# EAGLE design WallFollower-Circle (EAGLE 9.5.2)
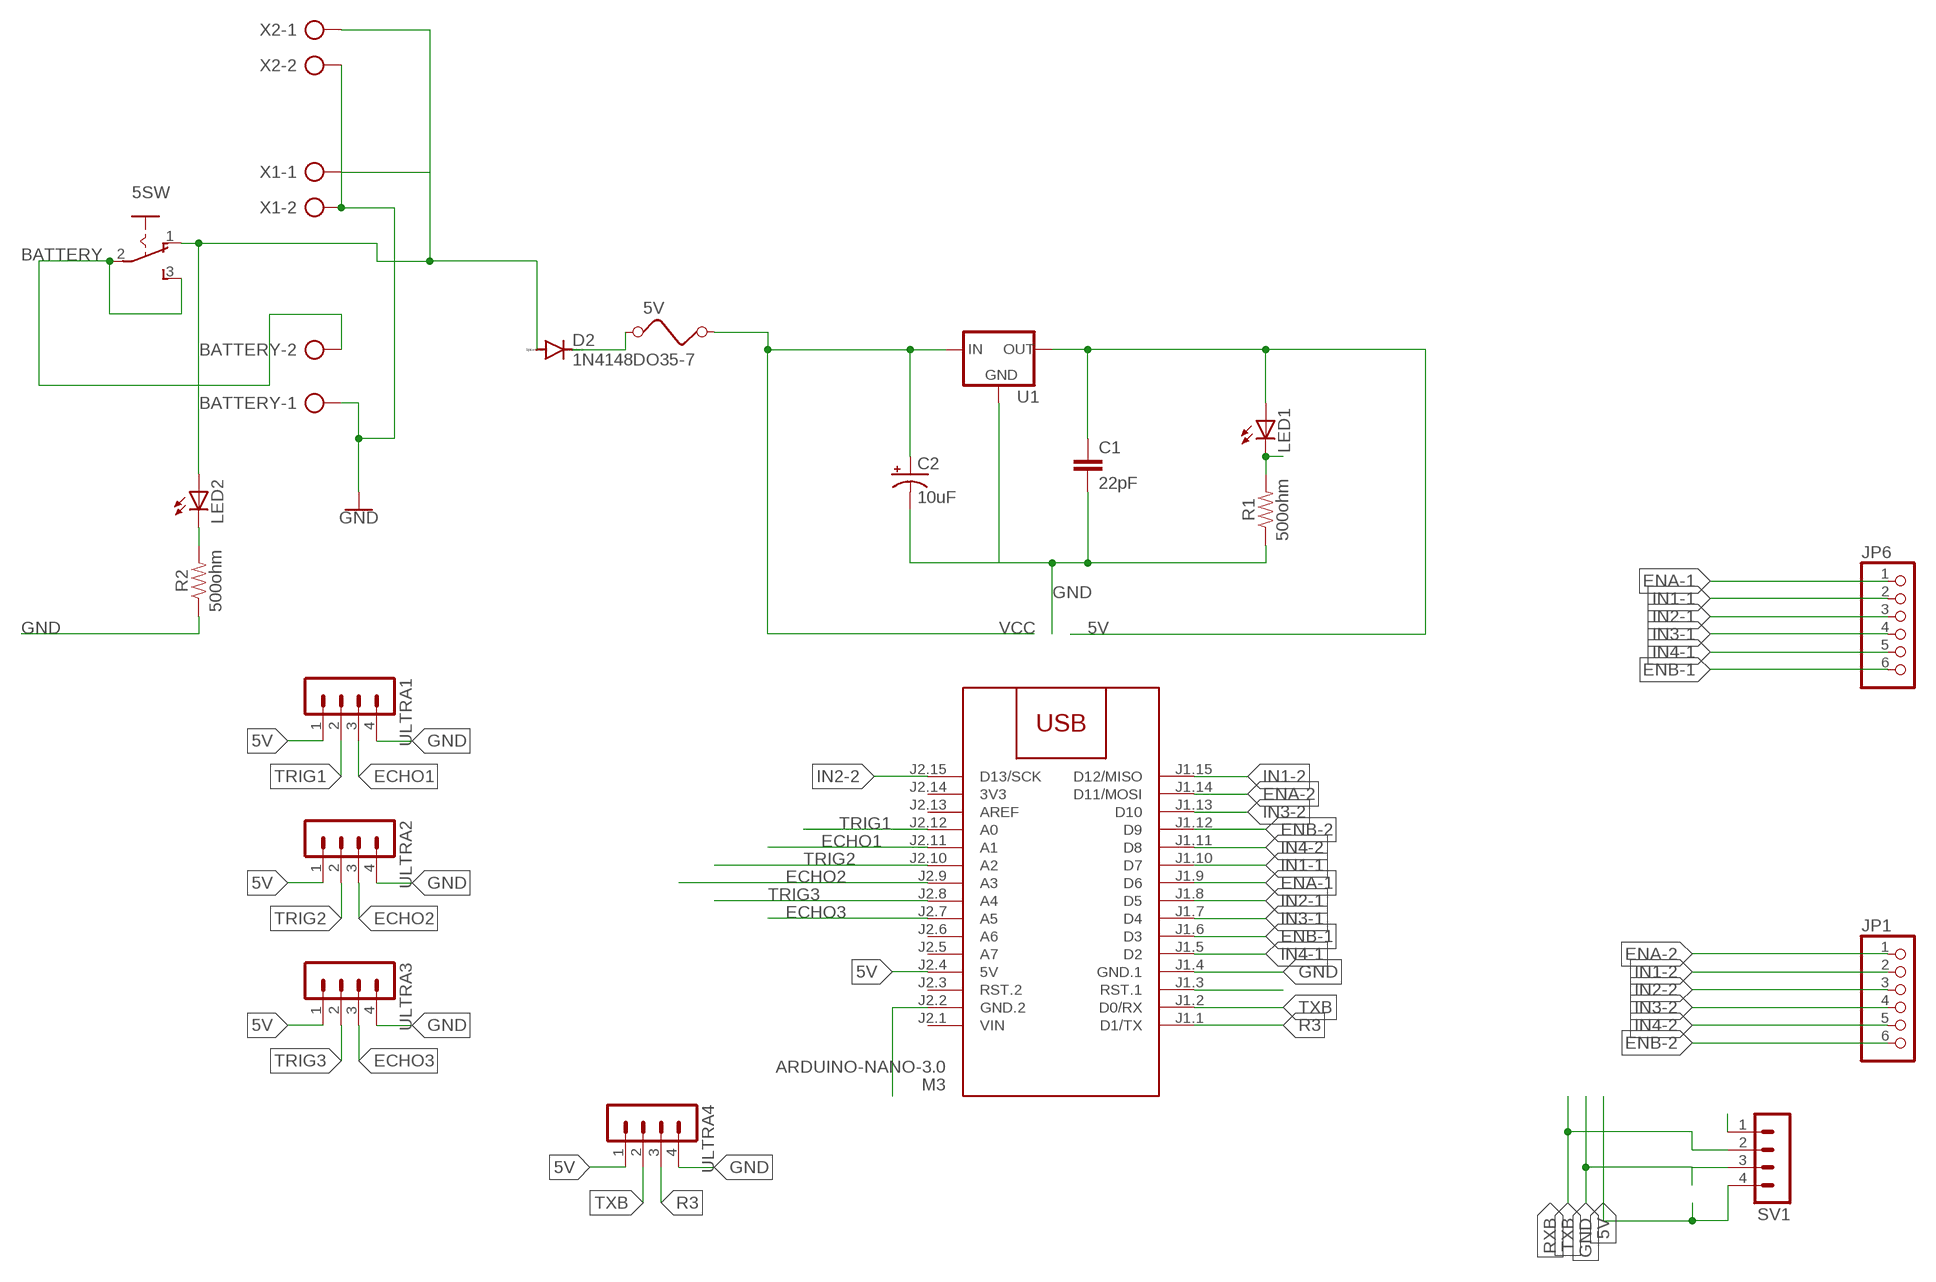
[diagram p0: schematic, sheet 1]

## Parts
5SW  255SB  [255SB]
5V  FUSE  [FUSE]
BATTERY  AK500/2-H  [AK500/2-H]
C1  22pF  22PF-PTH-2.54MM-200V-5%  [CAP-PTH-2.54]
C2  10uF  10UF-POLAR-RADIAL-2.5MM-25V-20%  [CPOL-RADIAL-2.5MM-5MM]
D2  1N4148DO35-7  [DO35-7]
JP1  PINHD-1X6  [1X06]
JP6  PINHD-1X6  [1X06]
LED1  LED3MM  [LED3MM]
LED2  LED3MM  [LED3MM]
M3  ARDUINO-NANO-3.0  [ARDUINO-NANO-3.0]
R1  500ohm  10MOHM-HORIZ-1/4W-5%  [AXIAL-0.3]
R2  500ohm  10MOHM-HORIZ-1/4W-5%  [AXIAL-0.3]
SV1  MA04-1  [MA04-1]
U1  78XXS  [78XXS]
ULTRA1  MA04-1  [MA04-1]
ULTRA2  MA04-1  [MA04-1]
ULTRA3  MA04-1  [MA04-1]
ULTRA4  MA04-1  [MA04-1]
X1  AK500/2-H  [AK500/2-H]
X2  AK500/2-H  [AK500/2-H]

## Nets
5V: C1.1 LED1.A M3.J2.4(5V) SV1.4 U1.OUT ULTRA1.1 ULTRA2.1 ULTRA3.1 ULTRA4.1
5V1: 5SW.1(O) D2.A LED2.A X1.1 X2.1
BATTERY: 5SW.2(P) 5SW.3(S) BATTERY.2
ECHO1: M3.J2.11(A1) ULTRA1.3
ECHO2: M3.J2.9(A3) ULTRA2.3
ECHO3: M3.J2.7(A5) ULTRA3.3
ENA-1: JP6.1 M3.J1.9(D6)
ENA-2: JP1.1 M3.J1.14(D11/MOSI)
ENB-1: JP6.6 M3.J1.6(D3)
ENB-2: JP1.6 M3.J1.12(D9)
GND: BATTERY.1 C1.2 C2.2(-) M3.J1.4(GND.1) M3.J2.2(GND.2) R1.P$1 R2.P$1 SV1.3 U1.GND ULTRA1.4 ULTRA2.4 ULTRA3.4 ULTRA4.4 X1.2 X2.2
IN1-1: JP6.2 M3.J1.10(D7)
IN1-2: JP1.2 M3.J1.15(D12/MISO)
IN2-1: JP6.3 M3.J1.8(D5)
IN2-2: JP1.3 M3.J2.15(D13/SCK)
IN3-1: JP6.4 M3.J1.7(D4)
IN3-2: JP1.4 M3.J1.13(D10)
IN4-1: JP6.5 M3.J1.5(D2)
IN4-2: JP1.5 M3.J1.11(D8)
N$1: M3.J1.3(RST.1)
N$2: 5V.1 D2.C
N$4: LED2.K(C) R2.P$2
N$5: LED1.K(C) R1.P$2
R3: M3.J1.1(D1/TX) ULTRA4.3
RXB: SV1.1
TRIG1: M3.J2.12(A0) ULTRA1.2
TRIG2: M3.J2.10(A2) ULTRA2.2
TRIG3: M3.J2.8(A4) ULTRA3.2
TXB: M3.J1.2(D0/RX) SV1.2 ULTRA4.2
VCC: 5V.2 C2.1(+) U1.IN
Unconnected: M3.J2.3(RST.2) M3.J2.5(A7) M3.J2.6(A6) M3.J2.13(AREF)

## Power pins joined to a net without a drawn wire
3V3: M3.J2.14(3V3)
VIN: M3.J2.1(VIN)

## Library data of the parts
5SW = switch:255SB: SLIDING SWITCH Distributor Buerklin, 11G810
5V = special:FUSE: FUSE 5 x 20 mm
BATTERY X1 X2 = con-ptr500:AK500/2-H: CONNECTOR Aug. 2004 / PTR Meßtechnik: Die Bezeichnung der Serie AK505 wurde geändert. Es handelt sich hierbei um AK500 in horizontaler Ausführung.; OC_FARNELL: unknown; OC_NEWARK: unknown
C1 = SparkFun-Capacitors:22PF: 22pF ceramic capacitors A capacitor is a passive two-terminal electrical component used to store electrical energy temporarily in an electric field.; PROD_ID: CAP-09128
C2 = SparkFun-Capacitors:10UF-POLAR: 10.0µF polarized capacitors A capacitor is a passive two-terminal electrical component used to store electrical energy temporarily in an electric field.; PROD_ID: CAP-08440
D2 = diode:1N4148: DIODE high speed (Philips)
JP1 JP6 = pinhead:PINHD-1X6: PIN HEADER
LED1 LED2 = adafruit:LED: LED OSRAM: - CHIPLED LG R971, LG N971, LY N971, LG Q971, LY Q971, LO R971, LY R971 LH N974, LH R974 LS Q976, LO Q976, LY Q976 LO Q996 - Hyper CHIPLED LW Q18S LB Q993, LB Q99A, LB R99A - SideLED LS A670, LO A670, LY A670, LG A670, LP A670 LB A673, LV A673, LT A673, LW A673 LH A674 LY A675 LS A676, LA A676, LO A676, LY A676, LW A676 LS A679, LY A679, LG A679 - Hyper Micro SIDELED® LS Y876, LA Y876, LO Y876, LY Y876 LT Y87S - SmartLED LW L88C, LW L88S LB L89C, LB L89S, LG L890 LS L89K, LO L89K, LY L89K LS L896, LA L896, LO L896, LY L896 - TOPLED LS T670, LO T670, LY T670, LG T670, LP T670 LSG T670, LSP T670, LSY T670, LOP T670, LYG T670 LG T671, LOG T671, LSG T671 LB T673, LV T673, LT T673, LW T673 LH T674 LS T676, LA T676, LO T676, LY T676, LB T676, LH T676, LSB T676, LW T676 LB T67C, LV T67C, LT T67C, LS T67K, LO T67K, LY T67K, LW E67C LS E67B, LA E67B, LO E67B, LY E67B, LB E67C, LV E67C, LT E67C LW T67C LS T679, LY T679, LG T679 LS T770, LO T770, LY T770, LG T770, LP T770 LB T773, LV T773, LT T773, LW T773 LH T774 LS E675, LA E675, LY E675, LS T675 LS T776, LA T776, LO T776, LY T776, LB T776 LHGB T686 LT T68C, LB T68C - Hyper Mini TOPLED® LB M676 - Mini TOPLED Santana® LG M470 LS M47K, LO M47K, LY M47K Source: http://www.osram.convergy.de/
M3 = diy-modules:ARDUINO-NANO-3.0: Arduino Nano 3.0 and compatible devices More details available here: https://www.arduino.cc/en/Main/ArduinoBoardNano Click here to find device on ebay.com <http://www.ebay.com/sch/arduino+nano>
R1 R2 = SparkFun-Resistors:10MOHM: RES-09327; PROD_ID: RES-09327; VALUE: 10M
SV1 ULTRA1-ULTRA4 = con-lstb:MA04-1: PIN HEADER; OC_FARNELL: unknown; OC_NEWARK: unknown
U1 = v-reg:78XXS: VOLTAGE REGULATOR

## Board
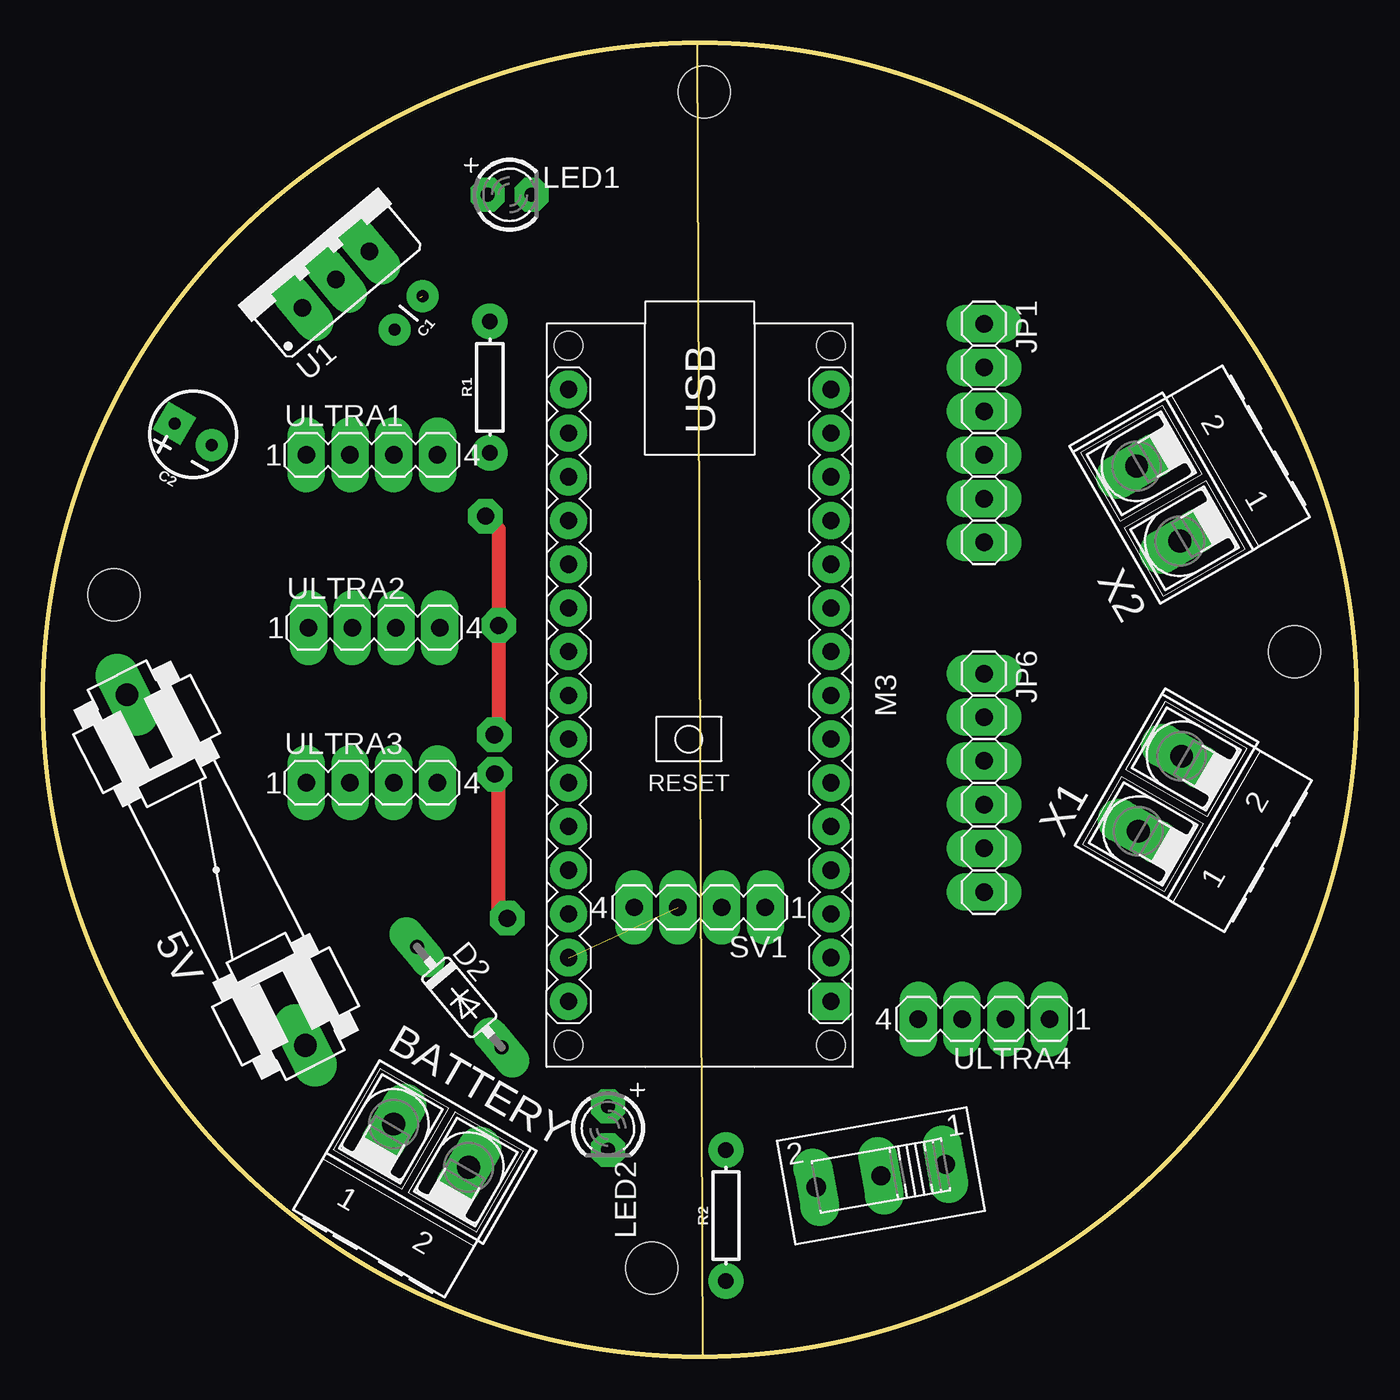
[diagram p1: board, top side]
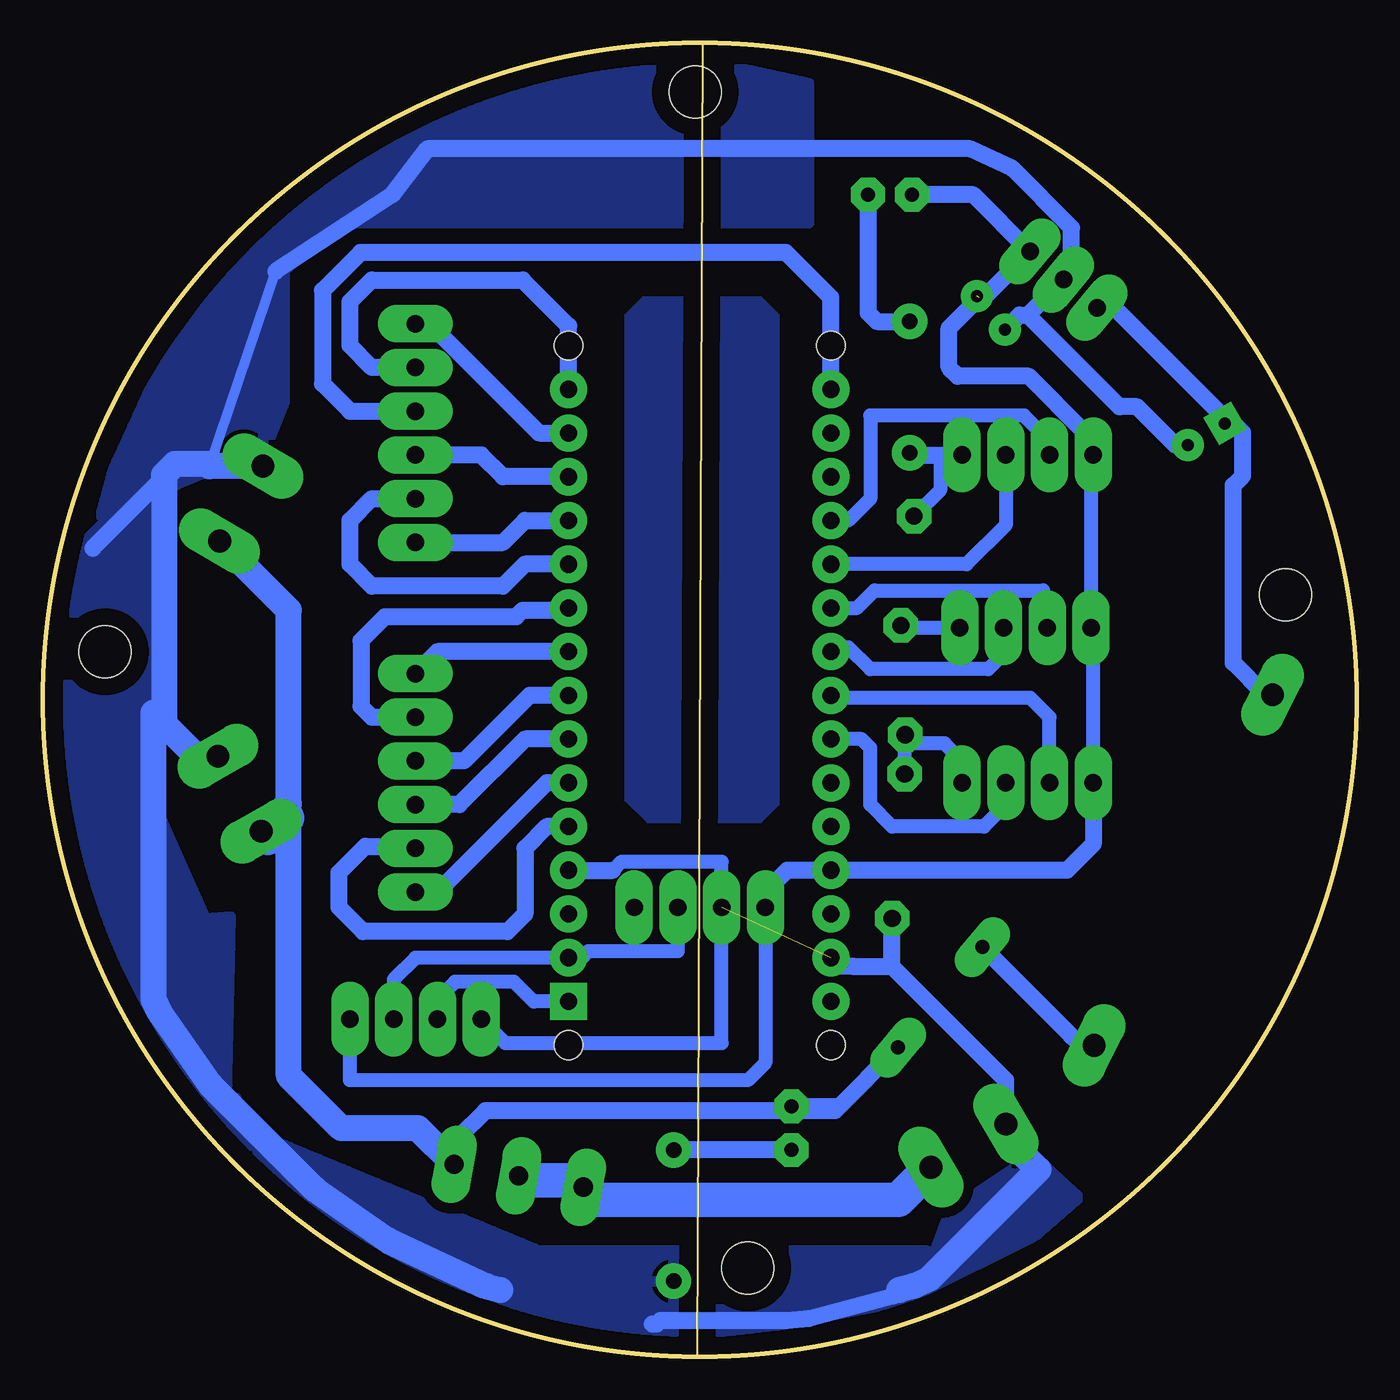
[diagram p2: board, bottom side, seen from below]

Size 76.3 x 76.3 mm. Coordinates in mm from the lower left corner, seen from the top.
Outline: circle at 38.15,38.15 radius 38.15
Copper layers (1*16): Top 0.035mm / dielectric 1.5mm / Bottom 0.035mm
Design rules "default *": minimum track width 6mil, minimum drill 0.35mm, track to track 0.6mm, track to pad 0.8mm, pad to pad 6mil, via to via 6mil, smd to smd 6mil, copper to edge 40mil, drill to drill 6mil, minimum pad ring 0.58mm, minimum via ring 8mil, stop-mask expansion 4mil, vias tented up to drill 0mil, thermal gap 10mil
Holes 3 mm at 38.41,73.46 72.7,40.95 4.12,44.25 35.36,5.13

### Footprints (pad centres in the part's own frame; a part is rotated, then mirrored left to right if it is on the bottom)
255SB = drill 1.118 long: 1 -3.81,0; 2 0,0; 3 3.81,0
FUSE = drill 1.321 long: 1 -11.43,0; 2 11.43,0
AK500/2-H = drill 1.321 long: 1 -2.515,0; 2 2.515,0
CAP-PTH-2.54 = drill 0.7 pad 1.651: 1 -1.27,0; 2 1.27,0
CPOL-RADIAL-2.5MM-5MM = drill 0.7 pad 1.651 square: 1 1.25,0 | drill 0.7 pad 1.651: 2 -1.25,0
DO35-7 = drill 0.813 long: A 3.81,0; C -3.81,0
1X06 = drill 1.016 long: 1 -6.35,0; 2 -3.81,0; 3 -1.27,0; 4 1.27,0; 5 3.81,0; 6 6.35,0
LED3MM = drill 0.813 pad 1.676 octagon: A -1.27,0; K 1.27,0
ARDUINO-NANO-3.0 = drill 1 square: J1.1 17.78,7.62 | drill 1: J1.2 15.24,7.62; J1.3 12.7,7.62; J1.4 10.16,7.62; J1.5 7.62,7.62; J1.6 5.08,7.62; J1.7 2.54,7.62; J1.8 0,7.62; J1.9 -2.54,7.62; J1.10 -5.08,7.62; J1.11 -7.62,7.62; J1.12 -10.16,7.62; J1.13 -12.7,7.62; J1.14 -15.24,7.62; J1.15 -17.78,7.62; J2.1 17.78,-7.62; J2.2 15.24,-7.62; J2.3 12.7,-7.62; J2.4 10.16,-7.62; J2.5 7.62,-7.62; J2.6 5.08,-7.62; J2.7 2.54,-7.62; J2.8 0,-7.62; J2.9 -2.54,-7.62; J2.10 -5.08,-7.62; J2.11 -7.62,-7.62; J2.12 -10.16,-7.62; J2.13 -12.7,-7.62; J2.14 -15.24,-7.62; J2.15 -17.78,-7.62 | hole 1.651: -20.32,7.62; -20.32,-7.62; 20.32,-7.62; 20.32,7.62
AXIAL-0.3 = drill 0.9 pad 1.88: P$1 -3.81,0; P$2 3.81,0
MA04-1 = drill 1.016 long: 1 -3.81,0; 2 -1.27,0; 3 1.27,0; 4 3.81,0
78XXS = drill 1.016 long: GND 0,-2.54; IN -2.54,-2.54; OUT 2.54,-2.54

### Placement (x,y rotation side)
5SW  48.68,10.5 190 top
5V  10.06,28.25 117 top
BATTERY  22.55,12.25 330 top
C1  21.24,60.62 230 top
C2  8.72,53.58 150 top
D2  24.18,20.86 310 top
JP1  54.66,53.65 270 top
JP6  54.66,33.33 270 top
LED1  27.1,67.49 0 top
LED2  32.82,13.26 270 top
M3  38.15,38.41 270 top
R1  25.96,56.31 90 top
R2  39.68,8.18 90 top
SV1  38.15,26.09 180 top
U1  15.39,64.51 40 top
ULTRA1  19.1,52.38 0 top
ULTRA2  19.23,42.34 0 top
ULTRA3  19.1,33.33 0 top
ULTRA4  54.66,19.61 180 top
X1  64.89,32.69 60 top
X2  64.79,49.55 120 top

### Tracks (layer width: path | path; a pad name or v marks a point on that pad's centre or on a via)
5V  (1 unrouted)
  Bottom 0.8: ULTRA1.1 15.42,52.38 ULTRA2.1 15.29,42.22 ULTRA3.1 | ULTRA4.1 58.47,16.05 35.36,16.05 34.34,17.07 SV1.4
  Bottom 1: LED1.A 22.27,67.49 U1.OUT 21.57,61.59 C1.1 | ULTRA3.1 15.29,29.77 16.82,28.25 M3.J2.4 33.07,28.25 34.34,26.98 SV1.4 | ULTRA1.1 15.77,52.85 15.77,53.68 19.04,56.95 23.17,56.95 23.67,57.46 23.67,59.74 21.9,61.52
5V1
  Bottom 1: 5SW.1 52.12,11.46 52.12,12.75 50.6,14.28 30.3,14.28 D2.A 30.04,14.53 LED2.A
  Bottom 1.5: 62.11,31.28 62.03,31.2 62.03,16.31 58.98,13.26 54.53,13.26 5SW.1 | X1.1 62.03,32.12 62.03,43.35 X2.1
  Bottom 2: 62.11,31.28 63.25,30.13 X1.1
BATTERY
  Bottom 2: BATTERY.2 26.61,9.1 44.19,9.1 5SW.3 45.33,10.24 48.42,10.24 5SW.2
ECHO1
  Bottom 0.8: ULTRA1.3 20.37,48.31 22.66,46.03 M3.J2.11
ECHO2
  Bottom 0.8: ULTRA2.3 20.5,40.82 21.39,39.93 28.25,39.93 29.52,41.2 30.28,41.2 M3.J2.9
ECHO3
  Bottom 0.8: ULTRA3.3 20.37,32.06 21.64,30.79 26.98,30.79 28.25,32.06 28.25,35.36 28.75,35.87 M3.J2.7
ENA-1
  Bottom 1: M3.J1.9 53.39,40.95 JP6.1
ENA-2
  Bottom 1: JP1.1 54.63,60.03 53.87,60.03 47.49,53.65 M3.J1.14
ENB-1
  Bottom 1: M3.J1.6 47.04,33.33 53.39,26.98 JP6.6
ENB-2
  Bottom 1: JP1.6 49.58,47.3 48.31,48.57 M3.J1.12
GND  (via drill 1 pad 2)  (1 unrouted)
  Top 0.8: v25.71,48.82 26.47,48.06 v26.47,42.47 | 26.47,42.22 v26.47,42.47 | v26.21,36.12 26.47,36.37 v26.47,42.47 | v26.98,25.45 26.47,25.45 26.47,33.61 v26.25,33.83
  Bottom 0.6: 62.79,63.04 66.6,51.85 66.64,51.73
  Bottom 0.8: ULTRA1.4 24.18,52.38 24.18,50.34 v25.71,48.82 | v26.47,42.47 26.34,42.34 ULTRA2.4 | ULTRA3.4 22.91,34.6 23.93,35.61 25.71,35.61 v26.21,36.12 26.25,36.09 v26.25,33.83 | v26.98,25.45 26.98,24.69 | ULTRA4.4 49.46,18.21 36.88,18.21 SV1.3 36.88,28.75 42.69,28.75 43.19,28.25
  Bottom 1: ULTRA1.4 25.83,52.38 R1.P$1 | M3.J1.4 43.19,28.25 | 19.1,60.5 17.58,62.03 17.56,62.03 U1.GND 17.02,63.3 16.55,63.77 16.55,65.58 20,69.02 22.43,70.16 53.98,70.16 56.04,67.47 62.79,63.04 | C2.2 10.54,52.95 12.75,55.17 13.77,55.17 19.1,60.5 | 26.98,22.66 v26.98,25.45 | BATTERY.1 20.37,16.05 26.98,22.66 | M3.J2.2 30.05,22.68 29.24,22.68 29.22,22.66 26.98,22.66 | C1.2 19.57,60.5 19.1,60.5 | 69.27,51.11 73.41,46.96 | 26.56,3.86 26.91,3.51 31.81,2.2 33.11,2.08 40.44,2.08 40.64,1.89 40.92,1.89
  Bottom 1.5: X2.2 66.64,51.73 | 66.6,51.85 68.65,51.85 69.27,51.23 69.27,51.11 69.27,36.76 | 69.27,36.76 67.38,34.87 X1.2 | 69.27,36.76 69.9,37.39 69.9,20.77 69.55,20.02 66.59,15.79 60.51,9.71 56.28,6.75 50.55,4.08 49.74,3.86 | 26.56,3.86 25.75,4.08 24.78,4.53 18.47,10.84 20.37,12.74 BATTERY.1
  pour Bottom: 16.09,9.25 18.75,6.96 25.45,3.61 23.65,8.45 18.76,11.71
  pour Bottom: 31.8,65.84 31.8,73.97 37.64,75.24 40.95,74.98 47.04,74.22 52.88,71.93 57.71,69.65 60,67.62 62.54,65.84 66.09,62.03 69.65,57.2 72.19,51.61 72.95,48.82 63.31,52.79 62.28,55.45 62.28,63.04 59.23,65.84
  pour Bottom: 24.94,6.15 47.44,6.15 64.06,13.01 63.45,10.16 59.49,8.18 56.69,6.15 54.15,4.88 49.07,3.1 45.77,1.83 42.47,1.58 37.9,1.32 33.33,1.83 25.45,3.35 24.94,5.89
  pour Bottom: 65.65,15.04 65.39,25.57 66.85,25.45 70.16,32.88 70.16,38.64 69.27,39.2 69.27,49.53 70.2,51.06 73.97,47.3 75.24,43.23 75.49,38.66 74.98,33.83 73.97,29.52 72.7,24.18 70.66,20.37 68.12,16.05 65.08,12.24 63.7,11.26 65.08,15.04
IN1-1
  Bottom 1: M3.J1.10 45.9,43.36 48.44,43.36 48.82,42.98 56.44,42.98 57.84,41.58 57.84,37.77 57.2,37.14 JP6.2
IN1-2
  Bottom 1: JP1.2 57.2,57.46 58.47,58.73 58.47,61.27 57.2,62.54 48.44,62.54 45.77,59.87 M3.J1.15
IN2-1
  Bottom 1: M3.J1.8 48.04,38.41 51.85,34.6 JP6.3
IN2-2
  Bottom 1: M3.J2.15 30.53,61.52 33.15,64.14 57.87,64.14 60.07,61.93 60.07,56.52 58.47,54.92 JP1.3
IN3-1
  Bottom 1: M3.J1.7 48.31,35.87 52.12,32.06 JP6.4
IN3-2
  Bottom 1: JP1.4 50.85,52.38 49.58,51.11 M3.J1.13
IN4-1
  Bottom 1: M3.J1.5 47.04,30.79 48.31,29.52 48.31,25.71 49.33,24.69 57.71,24.69 59.11,26.09 59.11,28.12 57.58,29.64 54.79,29.64 JP6.5
IN4-2
  Bottom 1: M3.J1.11 48.31,46.03 49.58,44.76 57.2,44.76 58.47,46.03 58.47,48.57 57.2,49.84 JP1.5
K
  pour Bottom: 33.58,60.5 33.58,32.06 34.6,31.04 41.2,31.04 42.47,32.31 42.47,60.5 41.45,61.52 34.6,61.52
N$2
  Bottom 1: 5V.1 arc45 16.56,18.61 D2.C
N$4
  Bottom 1: LED2.K R2.P$2
N$5
  Bottom 1: R1.P$2 27.87,60.12 28.37,60.63 LED1.K
R3
  Bottom 0.8: M3.J1.1 47.8,20.63 48.94,21.77 52.38,21.77 53.39,20.75 ULTRA4.3
TRIG1
  Bottom 0.8: ULTRA1.2 17.83,53.18 19.31,54.66 28.25,54.66 28.25,49.84 29.52,48.57 M3.J2.12
TRIG2
  Bottom 0.8: M3.J2.10 29.01,43.49 27.99,44.5 18.21,44.5 18.21,42.6 ULTRA2.2
TRIG3
  Bottom 0.8: ULTRA3.2 17.83,37.14 18.97,38.28 30.4,38.28 M3.J2.8
TXB
  Bottom 0.8: ULTRA4.2 55.93,21.9 54.66,23.17 M3.J1.2 45.01,23.17 44.63,23.55 39.42,23.55 SV1.2
VCC
  Bottom 1: U1.IN 14.06,60.93 7.64,54.5 C2.1 7.39,54.46 6.62,53.69 6.62,51.15 7.16,50.6 7.16,40.31 5.29,38.44 5V.2